# Altium project KeyBoardProject.PrjPcb
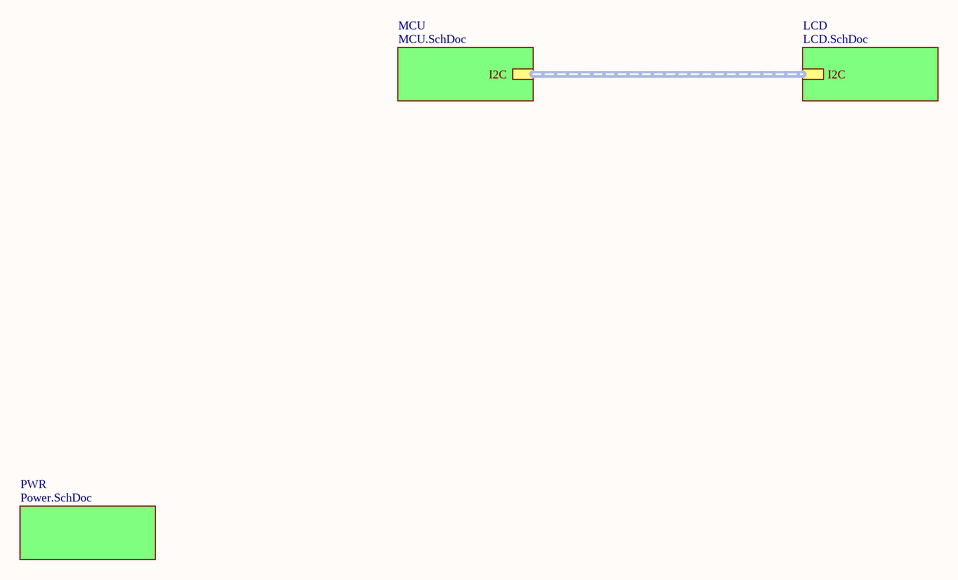
[diagram p0: MainSchDoc.SchDoc]
4 sheets, 58 parts. Net scope: hierarchical (ports join the sheet entries above them; power ports are global).
Board file: KeyBoard.PcbDoc
Sheets:
  MainSchDoc.SchDoc
    MCU = MCU.SchDoc
    LCD = LCD.SchDoc
    PWR = Power.SchDoc

## Sheet MainSchDoc.SchDoc
size A

### Sub-sheets
LCD = LCD.SchDoc: I2C (harness I2C)
MCU = MCU.SchDoc: I2C (harness I2C)
PWR = Power.SchDoc: no entries

### Buses and harness runs
harness sheet LCD/I2C = sheet MCU/I2C

## Sheet MCU.SchDoc
size A
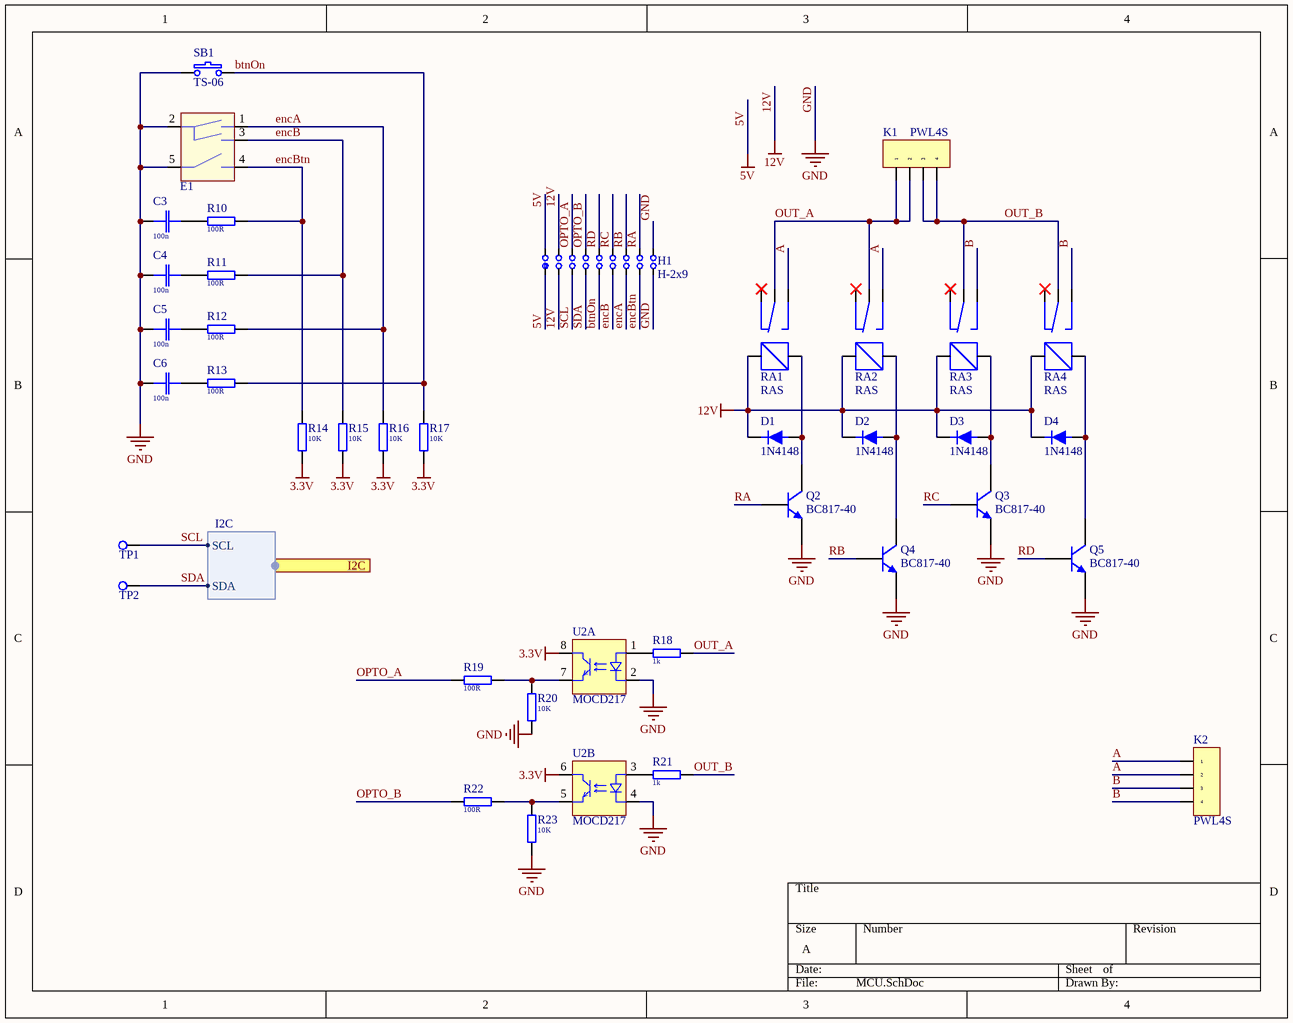
[diagram p1: MCU.SchDoc]

### Parts
C3  100n  [C0805(2013)]
C4  100n  [C0805(2013)]
C5  100n  [C0805(2013)]
C6  100n  [C0805(2013)]
D1  1N4148  [DO-214AC (SMA)]
D2  1N4148  [DO-214AC (SMA)]
D3  1N4148  [DO-214AC (SMA)]
D4  1N4148  [DO-214AC (SMA)]
E1  Encoder SW  [PEC12]  (value not drawn)
H1  H-2x9  [J2x9]
K1  PWL4S  [PWL4S]
K2  PWL4S  [PWL4S]
Q2  BC817-40  [SOT23_N]
Q3  BC817-40  [SOT23_N]
Q4  BC817-40  [SOT23_N]
Q5  BC817-40  [SOT23_N]
R10  100R  [R0805]
R11  100R  [R0805]
R12  100R  [R0805]
R13  100R  [R0805]
R14  10K  [R0805]
R15  10K  [R0805]
R16  10K  [R0805]
R17  10K  [R0805]
R18  1k  [R0805]
R19  100R  [R0805]
R20  10K  [R0805]
R21  1k  [R0805]
R22  100R  [R0805]
R23  10K  [R0805]
RA1  RAS  [Rele RAS]
RA2  RAS  [Rele RAS]
RA3  RAS  [Rele RAS]
RA4  RAS  [Rele RAS]
SB1  TS-06  [TS-06]
TP1  TP  [TP_TH]  (value not drawn)  (no BOM)
TP2  TP  [TP_TH]  (value not drawn)  (no BOM)
U2  MOCD217  [SO-8 (MOCD217)]  (parts A,B of 2)

### Ports
I2C (harness I2C)

### Harnesses
I2C: SCL, SDA

### Nets
3.3V: R14.1 R15.1 R16.1 R17.1 U2.6(C) U2.8(C)  [project net VDD]
5V: H1.1 H1.2
12V: D1.2(C) D2.2(C) D3.2(C) D4.2(C) H1.3 H1.4 RA1.1(a) RA2.1(a) RA3.1(a) RA4.1(a)
GND: C3.2 C4.2 C5.2 C6.2 E1.2 E1.5 H1.17 H1.18 Q2.2(E) Q3.2(E) Q4.2(E) Q5.2(E) R20.2 R23.1 SB1.1 U2.2(K) U2.4(K)
A: K2.1 K2.2 RA1.5(NO) RA2.5(NO)
B: K2.3 K2.4 RA3.5(NO) RA4.5(NO)
btnOn: H1.9 R13.1 R17.2 SB1.2
encA: E1.1 H1.13 R12.1 R16.2
encB: E1.3 H1.11 R11.1 R15.2
encBtn: E1.4 H1.15 R10.1 R14.2
OPTO_A: H1.6 R19.2
OPTO_B: H1.8 R22.2
OUT_A: K1.1 K1.2 R18.1 RA1.4(O) RA2.4(O)
OUT_B: K1.3 K1.4 R21.1 RA3.4(O) RA4.4(O)
RA: H1.16 Q2.1(B)
RB: H1.14 Q4.1(B)
RC: H1.12 Q3.1(B)
RD: H1.10 Q5.1(B)
SCL: H1.5 TP1.1 ; port I2C.SCL
SDA: H1.7 TP2.1 ; port I2C.SDA
NetC3_1: C3.1 R10.2
NetC4_1: C4.1 R11.2
NetC5_1: C5.1 R12.2
NetC6_1: C6.1 R13.2
NetD1_1: D1.1(A) Q2.3(C) RA1.2(b)
NetD2_1: D2.1(A) Q4.3(C) RA2.2(b)
NetD3_1: D3.1(A) Q3.3(C) RA3.2(b)
NetD4_1: D4.1(A) Q5.3(C) RA4.2(b)
NetR18_2: R18.2 U2.1(A)
NetR19_1: R19.1 R20.1 U2.7(E)
NetR21_2: R21.2 U2.3(A)
NetR22_1: R22.1 R23.2 U2.5(E)

Not connected (* = marked no-connect by the designer): RA1 3(NC)*; RA2 3(NC)*; RA3 3(NC)*; RA4 3(NC)*

### Library data of the parts
C3-C6 = C-0805   50V 100n: SMD-0805 50V Y5V +80/-20%; Price: 0.05; Value: 100n
D1-D4 = 1N4148: DO-35 75V 0.2A 1uS 4A 4nS; Price: 0.02
E1 = Encoder SW: Mechanical encoder with switch; Sim Note: Enter the Resistance value and the set point into parameter fields.; Set Position: 0.5; Published: 8-Jun-2000; LatestRevisionDate: 17-Jul-2002; LatestRevisionNote: Re-released for DXP Platform.; PackageReference: VR5; Publisher: Altium Limited
K1 K2 = PWL4S: 3.96mm 7A/250V; Price: 0.17
Q2-Q5 = BC817-40: NPN General-purpose Transistor; Published: 17-Sep-2003; LatestRevisionDate: 12-Dec-2006; LatestRevisionNote: IPC-7351 Footprint Added.; DatasheetVersion: Jun-1999; PackageVersion: May-1999; PackageReference: SOT23; Publisher: Altium Limited; PackageDescription: 3-Pin SOT-23 Package 0.95 mm Pitch, 2.3 mm Lead Span; ComponentLink1Description: Manufacturer Link; ComponentLink1URL: http://www.semiconductors.philips.com/; ComponentLink2Description: Datasheet; ComponentLink2URL: http://www.semiconductors.philips.com/acrobat/datasheets/BC817_BC817W_BC337_5.pdf
R10-R23 = R-0805: SMD 0805 0.1W 5% 150V; Price: 0.017
  R10-R13 R19 R22: Value: 100R
  R14-R17 R20 R23: Value: 10K
  R18 R21: Value: 1k
RA1-RA4 = Relay RAS: AC-120V 15A DC-14V 20A 30V 15A /0.36W; Price: 1.8
SB1 = Buton TS-06: Price: 0.15
TP1 TP2 = TP: Test point
U2 = MOCD217: Dual optocouple
H1 = H-2x9: Price: 0.18

## Sheet LCD.SchDoc
size A
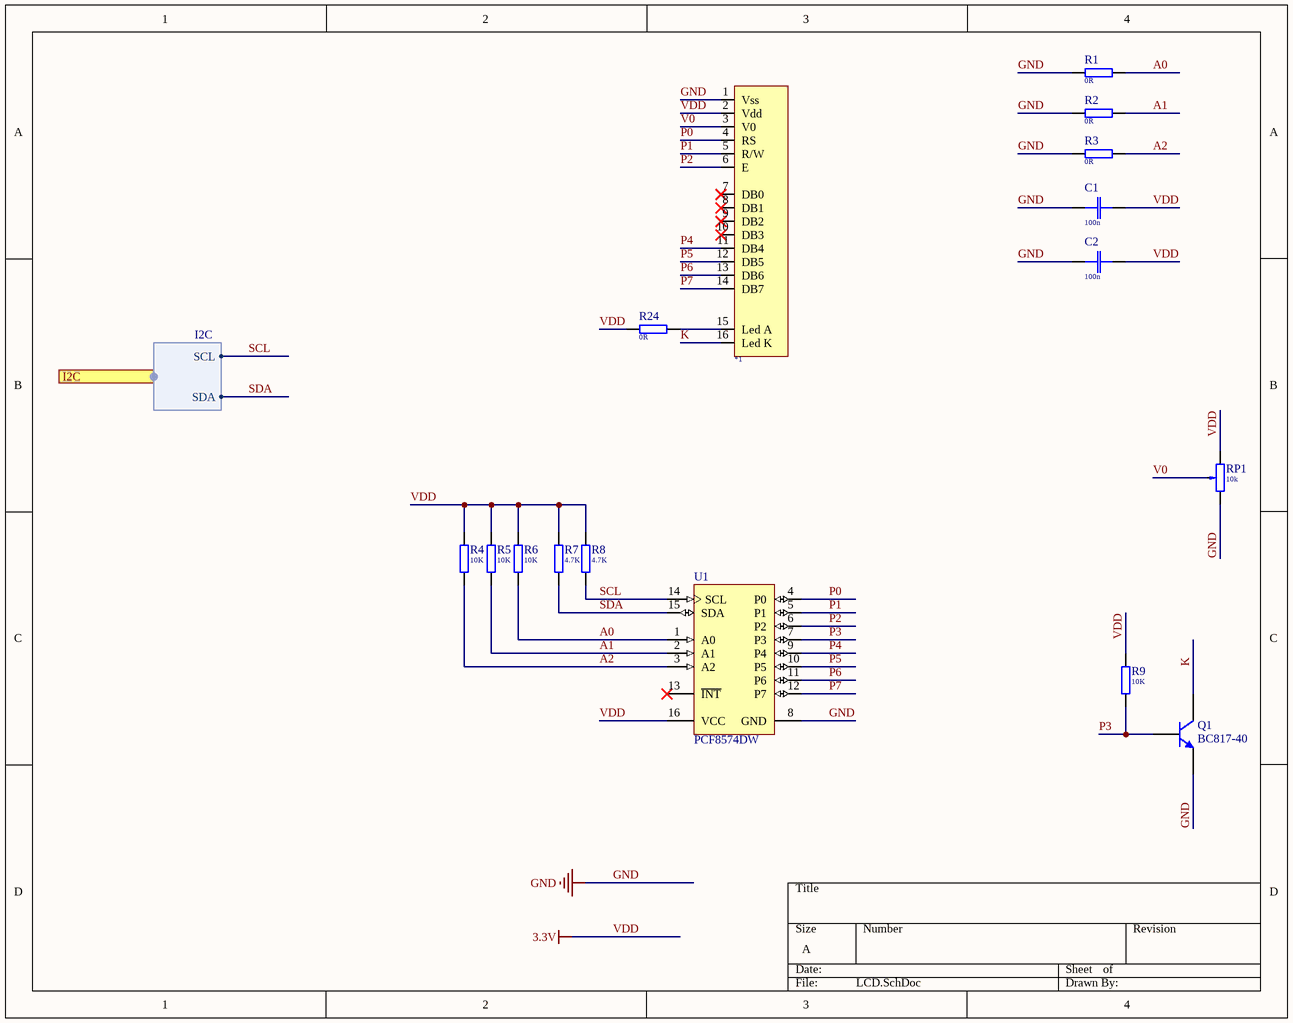
[diagram p2: LCD.SchDoc]

### Parts
*1  AC162B 2x16  [AC-162B 2x16]  (value not drawn)
C1  100n  [C0805(2013)]
C2  100n  [C0805(2013)]
Q1  BC817-40  [SOT23_N]
R1  0R  [R0805]
R2  0R  [R0805]
R3  0R  [R0805]
R4  10K  [R0805]
R5  10K  [R0805]
R6  10K  [R0805]
R7  4.7K  [R0805]
R8  4.7K  [R0805]
R9  10K  [R0805]
R24  0R  [R0805]
RP1  10k  [R-Tr 3362P]
U1  PCF8574DW  [DW16_N]

### Ports
I2C (harness I2C)

### Harnesses
I2C: SCL, SDA

### Nets
GND: *1.1(Vss) C1.1 C2.1 Q1.2(E) R1.2 R2.2 R3.2 RP1.1 U1.8(GND)
VDD: *1.2(Vdd) C1.2 C2.2 R4.2 R5.2 R6.2 R7.2 R8.2 R9.2 R24.2 RP1.3 U1.16(VCC)  [also labelled 3.3V]
A0: R1.1 R6.1 U1.1(A0)
A1: R2.1 R5.1 U1.2(A1)
A2: R3.1 R4.1 U1.3(A2)
K: *1.16(Led_K) Q1.3(C)
P0: *1.4(RS) U1.4(P0)
P1: *1.5(R/W) U1.5(P1)
P2: *1.6(E) U1.6(P2)
P3: Q1.1(B) R9.1 U1.7(P3)
P4: *1.11(DB4) U1.9(P4)
P5: *1.12(DB5) U1.10(P5)
P6: *1.13(DB6) U1.11(P6)
P7: *1.14(DB7) U1.12(P7)
SCL: R8.1 U1.14(SCL) ; port I2C.SCL
SDA: R7.1 U1.15(SDA) ; port I2C.SDA
V0: *1.3(V0) RP1.2
Net*1_15: *1.15(Led_A) R24.1

Not connected (* = marked no-connect by the designer): *1 7(DB0)* 8(DB1)* 9(DB2)* 10(DB3)*; U1 13(~{INT})*

### Library data of the parts
C1 C2 = C-0805   50V 100n: SMD-0805 50V Y5V +80/-20%; Price: 0.05; Value: 100n
Q1 = BC817-40: NPN General-purpose Transistor; Published: 17-Sep-2003; LatestRevisionDate: 12-Dec-2006; LatestRevisionNote: IPC-7351 Footprint Added.; DatasheetVersion: Jun-1999; PackageVersion: May-1999; PackageReference: SOT23; Publisher: Altium Limited; PackageDescription: 3-Pin SOT-23 Package 0.95 mm Pitch, 2.3 mm Lead Span; ComponentLink1Description: Manufacturer Link; ComponentLink1URL: http://www.semiconductors.philips.com/; ComponentLink2Description: Datasheet; ComponentLink2URL: http://www.semiconductors.philips.com/acrobat/datasheets/BC817_BC817W_BC337_5.pdf
R1-R9 R24 = R-0805: SMD 0805 0.1W 5% 150V; Price: 0.017
  R1-R3 R24: Value: 0R
  R4-R6 R9: Value: 10K
  R7 R8: Value: 4.7K
RP1 = R-Tr 3362F: Bourns 3362F 0.5W; Set Position: 0.5; Price: 0.2; Value: 10k
U1 = PCF8574DW: Remote 8-Bit I/O Expander for I2C-Bus, 2.5 to 6 V, -40 to 85 degC, 16-pin SOIC (DW), Green (RoHS & no Sb/Br); Manufacturer: Texas Instruments; SubFamily: I2C IO Expander; Voltage Nodes(V): 5, 3.3; Interrupt Output: Yes; fSCLK(Max)(MHz): 0.1; VCC(Min)(V): 2.5; VCC(Max)(V): 6; Max Frequency(kHz): 100; I2C Address: 0100 xxx; # of I/Os: 8; Vcc range(V): 2.5 to 6.0; DatasheetVersion: SCPS068G; PackageVersion: revG, Jan-2011; PackageReference: DW16; PackageDescription: 16-Pin Small Outline Integrated Circuit, 10.3 x 7.5 mm, Pitch 1.27 mm Pitch; Supplier 1: Digi-Key; Supplier Part Number 1: 296-26294-5-ND; Supplier 2: Newark; Supplier Part Number 2: 75C5236; Supplier 3: Mouser; Supplier Part Number 3: 595-PCF8574DW; Eco-Plan: Green (RoHS & no Sb/Br); Reset Input: No; Push-Pull I/O Type: Yes; Mounting Technology: Surface Mount; PartNumber: PCF8574DW; Code_JEDEC: MS-013-AA; ComponentLink1Description: Datasheet; ComponentLink1URL: http://www.ti.com/general/docs/lit/getliterature.tsp?genericPartNumber=PCF8574&fileType=pdf; ComponentLink2Description: Package Specification; ComponentLink2URL: http://www.ti.com/litv/pdf/msoi003g

## Sheet Power.SchDoc
size A
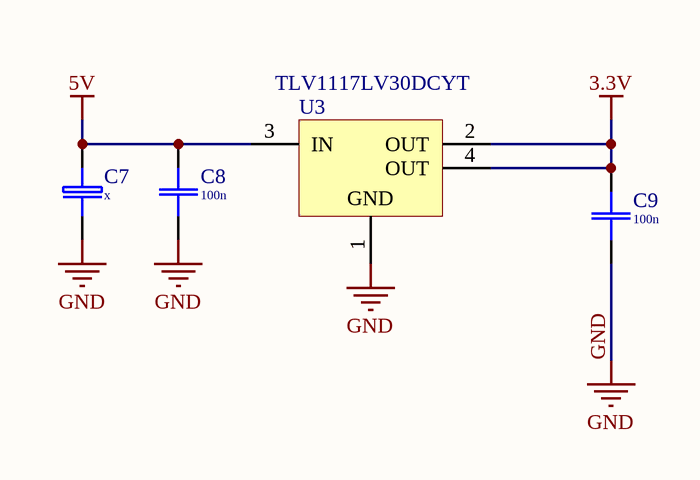
[diagram p3: Power.SchDoc]

### Parts
C7  x  [EL Case C (6032-28)]
C8  100n  [C0805(2013)]
C9  100n  [C0805(2013)]
U3  TLV1117LV30DCYT  [TI-DCY4_N]

### Nets
3.3V: C9.2 U3.2(OUT) U3.4(OUT)  [project net VDD]
5V: C7.1(+) C8.2 U3.3(IN)
GND: C7.2(-) C8.1 C9.1 U3.1(GND)

### Library data of the parts
C7 = EL Case C (6032-28): EL Tantalum Case C (6032-28); Price: 0.41; Value: x
C8 C9 = C-0805   50V 100n: SMD-0805 50V Y5V +80/-20%; Price: 0.05; Value: 100n
U3 = TLV1117LV30DCYT: Single Output LDO, 1 A, Fixed 3 V Output, 2 to 5.5 V Input, 4-pin SOT-223 (DCY), -40 to 125 degC, Green (RoHS & no Sb/Br); Manufacturer: Texas Instruments; Accuracy(%): 2; Fixed Output Options(V): 3; Iout(Max)(A): 1; Iq(Typ)(mA): 0.05; SubFamily: Single Channel LDO; Vdo(Typ)(mV): 1200; Vin(Max)(V): 5.5; DatasheetVersion: SBVS160A; PackageVersion: 4202506/B; PackageReference: DCY4; PackageDescription: 4-Pin Plastic Small Outline, Body 3.5 x 6.5 mm, Pitch 2.3 mm; Supplier 1: Digi-Key; Supplier Part Number 1: 296-34848-2-ND; Supplier 2: Farnell; Supplier Part Number 2: 2214986; Supplier 3: Newark; Supplier Part Number 3: 45W6437; Supplier 4: Newark; Supplier Part Number 4: 27W9631; Supplier 5: Mouser; Supplier Part Number 5: 595-TLV1117LV30DCYT; Eco-Plan: Green (RoHS & no Sb/Br); Vin(Min)(V): 2; Vout Adj(Max)(V): 3; Vout Adj(Min)(V): 3; Mounting Technology: Surface Mount; Code_JEDEC: TO-261; PartNumber: TLV1117LV30DCYT; ComponentLink1Description: Manufacturer URL; ComponentLink1URL: http://www.ti.com/; ComponentLink2Description: Datasheet; ComponentLink2URL: http://www.ti.com/general/docs/lit/getliterature.tsp?genericPartNumber=TLV1117LV30&fileType=pdf; ComponentLink3Description: Package Specification; ComponentLink3URL: http://www.ti.com/litv/pdf/mpds094a

## Nets that join several sheets
5V: MCU (H1.1 H1.2), Power (C7.1 C8.2 U3.3)
GND: MCU (17 pins), LCD (9 pins), Power (C7.2 C8.1 C9.1 U3.1)
VDD: MCU (6 pins), LCD (12 pins), Power (C9.2 U3.2 U3.4)
SCL: MCU (H1.5 TP1.1), LCD (R8.1 U1.14)
SDA: MCU (H1.7 TP2.1), LCD (R7.1 U1.15)